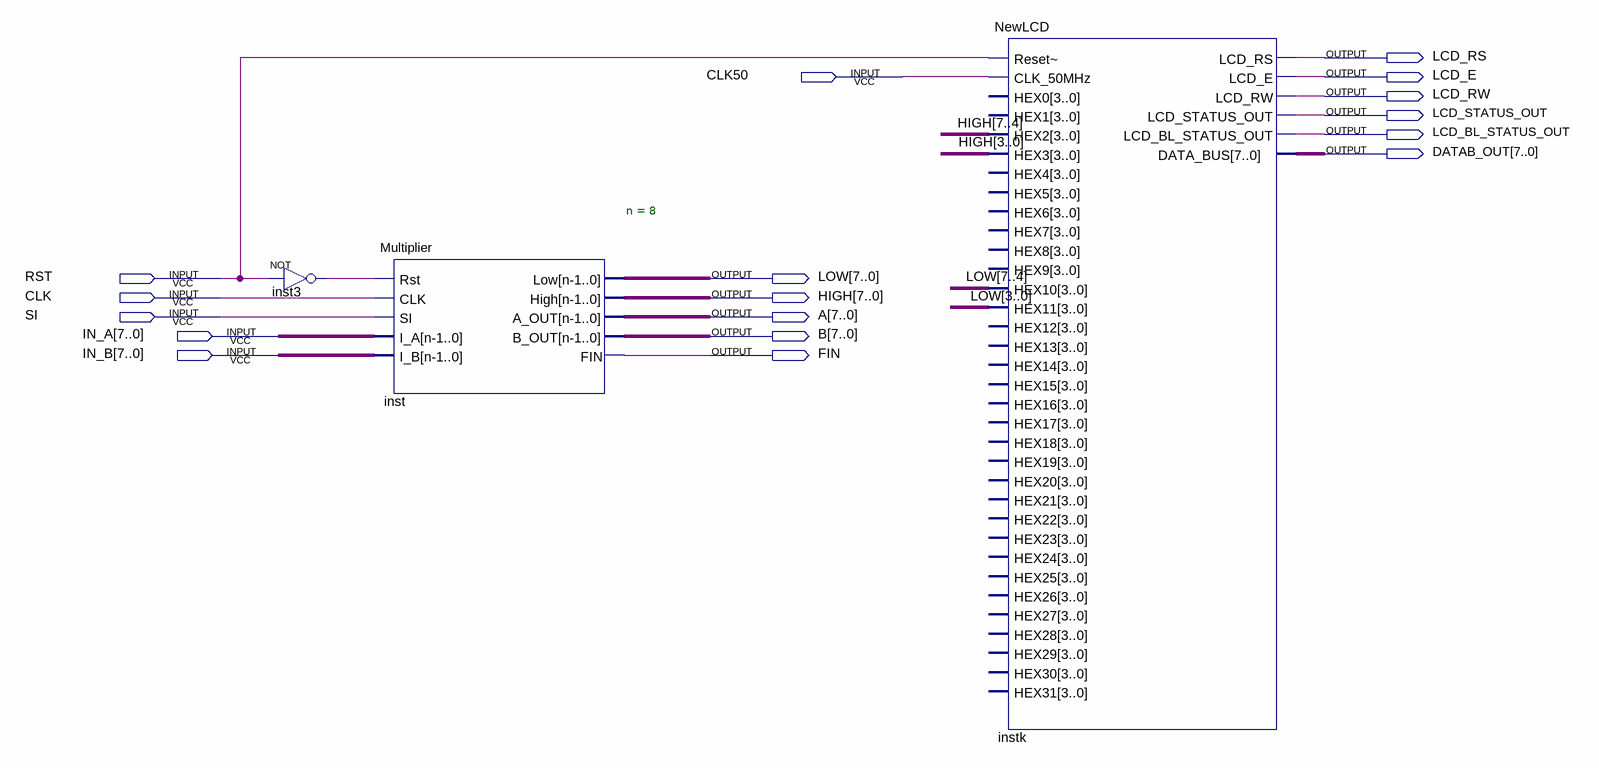
[diagram p0: schematic sheet]
// Quartus schematic Paradoteo6.bdf as structural Verilog: 3 symbols, 17 pins
module Paradoteo6 (
  input  CLK50,
  input  RST,
  input  CLK,
  input  SI,
  input  [7:0] IN_A,
  input  [7:0] IN_B,
  output LCD_RS,
  output LCD_E,
  output LCD_RW,
  output LCD_STATUS_OUT,
  output LCD_BL_STATUS_OUT,
  output [7:0] DATAB_OUT,
  output [7:0] LOW,
  output [7:0] HIGH,
  output [7:0] A,
  output [7:0] B,
  output FIN
);

  wire inst3_out;

  not inst3 (inst3_out, RST);
  Multiplier #(.n(8)) inst (
    .Rst(inst3_out), .CLK(CLK), .SI(SI), .I_A(IN_A), .I_B(IN_B), .Low(LOW), .High(HIGH), .A_OUT(A),
    .B_OUT(B), .FIN(FIN));
  NewLCD instk (
    .\Reset~ (RST), .CLK_50MHz(CLK50), .HEX2(HIGH[7:4]), .HEX3(HIGH[3:0]), .HEX10(LOW[7:4]),
    .HEX11(LOW[3:0]), .LCD_RS(LCD_RS), .LCD_E(LCD_E), .LCD_RW(LCD_RW), .LCD_STATUS_OUT(LCD_STATUS_OUT),
    .LCD_BL_STATUS_OUT(LCD_BL_STATUS_OUT), .DATA_BUS(DATAB_OUT));  // open: HEX0, HEX1, HEX4, HEX5, HEX6, HEX7, HEX8, HEX9, HEX12, HEX13, HEX14, HEX15, HEX16, HEX17, HEX18, HEX19, HEX20, HEX21, HEX22, HEX23, HEX24, HEX25, HEX26, HEX27, HEX28, HEX29, HEX30, HEX31
endmodule
